# Altium project 示波器.PrjPcb
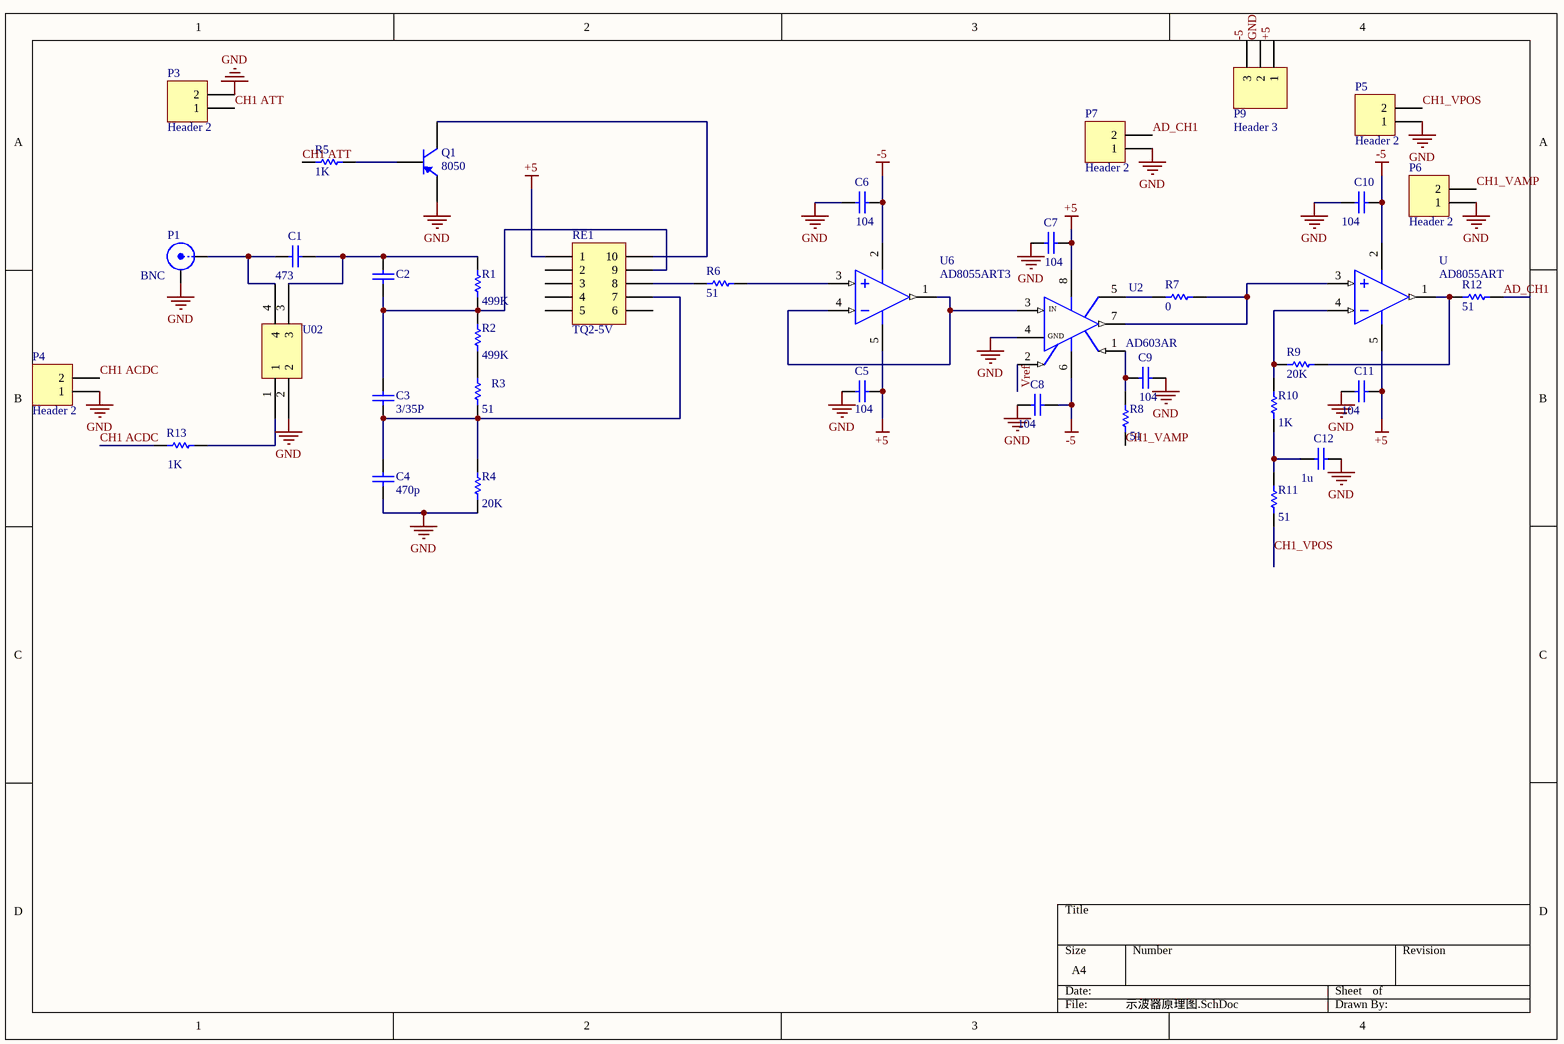
[diagram p0: 示波器原理图.SchDoc]
3 sheets, 99 parts. Net scope: global (net labels, ports and power ports of the same name join across sheets).
Board file: new示波器pcb.PcbDoc
Sheets:
  示波器原理图.SchDoc
  示波器原理图3.SchDoc
  示波器原理图7.SchDoc

## Sheet 示波器原理图.SchDoc
size A4

### Parts
C1  value 473  [PCBComponent_1]
C2  (no value)  [PCBComponent_1]
C3  value 3/35P  [PCBComponent_1]
C4  value 470p  [PCBComponent_1]
C5  value 104  [PCBComponent_1]
C6  104  [PCBComponent_1]
C7  value 104  [PCBComponent_1]
C8  value 104  [PCBComponent_1]
C9  value 104  [PCBComponent_1]
C10  value 104  [PCBComponent_1]
C11  value 104  [PCBComponent_1]
C12  value 1u  [PCBComponent_1]
P1  BNC  [BNC_RA CON]
P3  Header 2  [HDR1X2]
P4  Header 2  [HDR1X2]
P5  Header 2  [HDR1X2]
P6  Header 2  [HDR1X2]
P7  Header 2  [HDR1X2]
P9  Header 3  [HDR1X3]
Q1  8050  [PCBComponent_1]
R1  value 499K  [PCBComponent_1]
R2  value 499K  [PCBComponent_1]
R3  value 51  [PCBComponent_1]
R4  value 20K  [2012[0805]]
R5  value 1K  [PCBComponent_1]
R6  value 51  [PCBComponent_1]
R7  value 0  [2012[0805]]
R8  value 51  [2012[0805]]
R9  value 20K  [2012[0805]]
R10  value 1K  [2012[0805]]
R11  value 51  [2012[0805]]
R12  value 51  [2012[0805]]
R13  value 1K  [PCBComponent_1]
RE1  TQ2-5V  [PCBComponent_1]
U  AD8055ART  [SOT95P245X110-5N]
U2  AD603AR  [SOIC127P600X175-8N]
U02  (no value)  [SOP254P610X218-4N]
U6  AD8055ART3  [SOT95P245X110-5N]

### Nets
+5: C5.1 C7.2 C11.2 P9.1 RE1.1 U.5(V+) U2.8(V+) U6.5(V+)
-5: C6.1 C8.2 C10.2 P9.3 U.2(V-) U2.6(V-) U6.2(V-)
GND: C4.1 C5.2 C6.2 C7.1 C8.1 C9.2 C10.1 C11.1 C12.2 P1.2(Y) P3.2 P4.1 P5.1 P6.1 P7.1 P9.2 Q1.1(E) R4.1 U02.2 U2.4(COMM)
AD_CH1: P7.2 R12.1
CH1 ACDC: P4.2 R13.1
CH1 ATT: P3.1 R5.2
CH1_VAMP: P6.2 R8.1
CH1_VPOS: P5.2 R11.1
Vref: U2.2(G-)
NetC1_1: C1.1 P1.1(X) U02.4
NetC1_2: C1.2 C2.2 R1.2 U02.3
NetC2_1: C2.1 C3.2 R1.1 R2.2 RE1.9
NetC3_1: C3.1 C4.2 R3.1 R4.2 RE1.7
NetC9_1: C9.1 R8.2 U2.1(G+)
NetC12_1: C12.1 R10.1 R11.2
NetQ1_2: Q1.2(B) R5.1
NetQ1_3: Q1.3(C) RE1.10
NetR2_1: R2.1 R3.2
NetR6_1: R6.1 U6.3(IN+)
NetR6_2: R6.2 RE1.8
NetR7_1: R7.1 U.3(IN+) U2.7(VOUT)
NetR7_2: R7.2 U2.5(FDBK)
NetR9_1: R9.1 R12.2 U.1(OUT)
NetR9_2: R9.2 R10.2 U.4(IN-)
NetR13_2: R13.2 U02.1
NetU2_3: U2.3(VINP) U6.1(OUT) U6.4(IN-)

Not connected (* = marked no-connect by the designer): RE1 2 3 4 5 6

### Notes on the sheet
- (in symbol AD603AR) IN; GND

### Library data of the parts
C1-C12 = Cap: Capacitor; Published: 8-Jun-2000; LatestRevisionDate: 17-Jul-2002; LatestRevisionNote: Re-released for DXP Platform.; PackageReference: RAD-0.3; Publisher: Altium Limited
P1 = BNC: BNC Elbow Connector; LatestRevisionDate: 17-Jul-2002; LatestRevisionNote: Re-released for DXP Platform.; Publisher: Altium Limited
P3-P7 = Header 2: Header, 2-Pin; LatestRevisionDate: 17-Jul-2002; LatestRevisionNote: Re-released for DXP Platform.; Publisher: Altium Limited
P9 = Header 3: Header, 3-Pin; LatestRevisionDate: 17-Jul-2002; LatestRevisionNote: Re-released for DXP Platform.; Publisher: Altium Limited
Q1 = 2N3906: PNP General Purpose Amplifier; Published: 8-Jun-2000; LatestRevisionDate: 15-Jan-2003; LatestRevisionNote: PCB Footprint 'BCY-W3/D4.7' replaced; DatasheetDocument: 1997; PackageDocument: Sep-1998; PackageReference: TO-92A; Publisher: Altium Limited; Code_JEDEC: TO-92A; ComponentLink1Description: Manufacturer Link; ComponentLink1URL: http://www.fairchildsemi.com/; ComponentLink2Description: Datasheet; ComponentLink2URL: http://www.fairchildsemi.com/ds/2N%2F2N3906.pdf
R1-R3 R5 R6 R13 = Res1: Resistor; Published: 8-Jun-2000; LatestRevisionDate: 17-Jul-2002; LatestRevisionNote: Re-released for DXP Platform.; PackageReference: AXIAL-0.3; Publisher: Altium Limited
R4 R7-R12 = Res Semi: Semiconductor Resistor; Published: 8-Jun-2000; LatestRevisionDate: 17-Jul-2002; LatestRevisionNote: Re-released for DXP Platform.; PackageReference: AXIAL-0.5; Publisher: Altium Limited
RE1 U02 = Component_1
U U6 = AD8055ART: Low Cost, 300MHz Voltage Feedback Amplifier; Text Field7: Published 8-Jun-2000
U2 = AD603AR: Low-Noise, 90MHz Variable Gain Amplifier; Text Field7: Published 8-Jun-2000, Modified 10-July-2000: SIM Model Added.

## Sheet 示波器原理图3.SchDoc
size A4
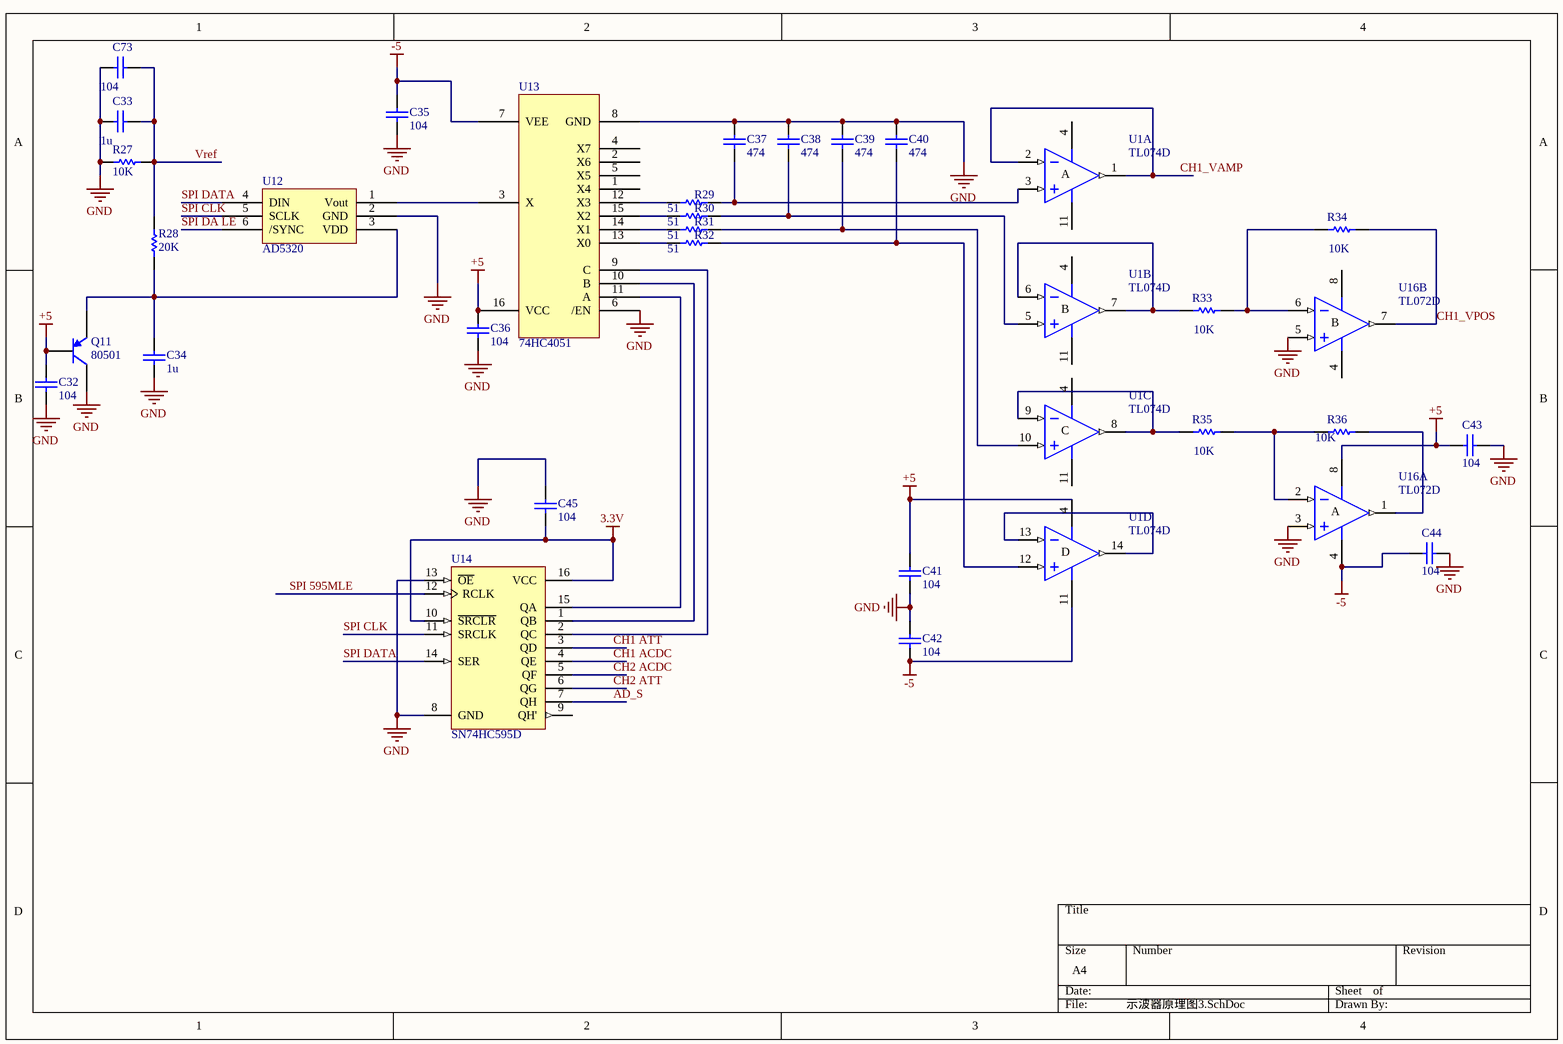
[diagram p1: 示波器原理图3.SchDoc]

### Parts
C32  value 104  [PCBComponent_1]
C33  value 1u  [PCBComponent_1]
C34  value 1u  [PCBComponent_1]
C35  value 104  [PCBComponent_1]
C36  value 104  [PCBComponent_1]
C37  value 474  [PCBComponent_1]
C38  value 474  [PCBComponent_1]
C39  value 474  [PCBComponent_1]
C40  value 474  [PCBComponent_1]
C41  value 104  [PCBComponent_1]
C42  value 104  [PCBComponent_1]
C43  value 104  [PCBComponent_1]
C44  value 104  [PCBComponent_1]
C45  value 104  [PCBComponent_1]
C73  value 104  [PCBComponent_1]
Q11  80501  [PCBComponent_1]
R27  value 10K  [PCBComponent_1]
R28  value 20K  [PCBComponent_1]
R29  51  [2012[0805]]
R30  51  [2012[0805]]
R31  51  [2012[0805]]
R32  51  [2012[0805]]
R33  value 10K  [2012[0805]]
R34  value 10K  [2012[0805]]
R35  value 10K  [2012[0805]]
R36  value 10K  [2012[0805]]
U1  TL074D  [SOP127P600X175-14N]  (parts A,B,C,D of 4)
U12  AD5320  [SOT86P280X110-6N]
U13  74HC4051  [SOP127P600X175-16N]
U14  SN74HC595D  [SOP127P600X175-16N]
U16  TL072D  [SOP127P600X175-8N]  (parts A,B of 2)

### Nets
3.3V: C45.1 U14.10(~{SRCLR}) U14.16(VCC)
+5: C32.2 C36.2 C41.1 C43.1 Q11.2(B) U1.4(V+) U13.16(VCC) U16.8(V+)
-5: C35.2 C42.2 C44.1 U1.11(V-) U13.7(VEE) U16.4(V-)
GND: C32.1 C33.1 C34.1 C35.1 C36.1 C37.2 C38.2 C39.2 C40.2 C41.2 C42.1 C43.2 C44.2 C45.2 C73.1 Q11.3(C) R27.2 U12.2(GND) U13.6(/EN) U13.8(GND) U14.8(GND) U14.13(~{OE}) U16.3(IN+) U16.5(IN+)
AD_S: U14.7(QH)
CH1 ACDC: U14.4(QE)
CH1 ATT: U14.3(QD)
CH1_VAMP: U1.1(OUT) U1.2(IN-)
CH1_VPOS: R34.2 U16.7(OUT)
CH2 ACDC: U14.5(QF)
CH2 ATT: U14.6(QG)
SPI 595MLE: U14.12(RCLK)
SPI CLK: U12.5(SCLK) U14.11(SRCLK)
SPI DA LE: U12.6(/SYNC)
SPI DATA: U12.4(DIN) U14.14(SER)
Vref: C33.2 C73.2 R27.1 R28.1
NetC34_2: C34.2 Q11.1(E) R28.2 U12.3(VDD)
NetC37_1: C37.1 R29.2 U1.3(IN+)
NetC38_1: C38.1 R30.2 U1.5(IN+)
NetC39_1: C39.1 R31.2 U1.10(IN+)
NetC40_1: C40.1 R32.2 U1.12(IN+)
NetR29_1: R29.1 U13.12(X3)
NetR30_1: R30.1 U13.15(X2)
NetR31_1: R31.1 U13.14(X1)
NetR32_1: R32.1 U13.13(X0)
NetR33_1: R33.1 U1.6(IN-) U1.7(OUT)
NetR33_2: R33.2 R34.1 U16.6(IN-)
NetR35_1: R35.1 U1.8(OUT) U1.9(IN-)
NetR35_2: R35.2 R36.1 U16.2(IN-)
NetR36_2: R36.2 U16.1(OUT)
NetU1_13: U1.13(IN-) U1.14(OUT)
NetU12_1: U12.1(Vout) U13.3(X)
NetU13_9: U13.9(C) U14.2(QC)
NetU13_10: U13.10(B) U14.1(QB)
NetU13_11: U13.11(A) U14.15(QA)

Not connected (* = marked no-connect by the designer): U13 1(X4) 2(X6) 4(X7) 5(X5); U14 9(QH')

### Notes on the sheet
- (in symbol TL072D, part A) A
- (in symbol TL072D, part B) B
- (in symbol TL074D, part A) A
- (in symbol TL074D, part B) B
- (in symbol TL074D, part C) C
- (in symbol TL074D, part D) D

### Library data of the parts
C32-C45 C73 = Cap: Capacitor; Published: 8-Jun-2000; LatestRevisionDate: 17-Jul-2002; LatestRevisionNote: Re-released for DXP Platform.; PackageReference: RAD-0.3; Publisher: Altium Limited
Q11 = 2N3906: PNP General Purpose Amplifier; Published: 8-Jun-2000; LatestRevisionDate: 15-Jan-2003; LatestRevisionNote: PCB Footprint 'BCY-W3/D4.7' replaced; DatasheetDocument: 1997; PackageDocument: Sep-1998; PackageReference: TO-92A; Publisher: Altium Limited; Code_JEDEC: TO-92A; ComponentLink1Description: Manufacturer Link; ComponentLink1URL: http://www.fairchildsemi.com/; ComponentLink2Description: Datasheet; ComponentLink2URL: http://www.fairchildsemi.com/ds/2N%2F2N3906.pdf
R27 R28 = Res1: Resistor; Published: 8-Jun-2000; LatestRevisionDate: 17-Jul-2002; LatestRevisionNote: Re-released for DXP Platform.; PackageReference: AXIAL-0.3; Publisher: Altium Limited
R29-R36 = Res Semi: Semiconductor Resistor; Published: 8-Jun-2000; LatestRevisionDate: 17-Jul-2002; LatestRevisionNote: Re-released for DXP Platform.; PackageReference: AXIAL-0.5; Publisher: Altium Limited
U1 = TL074D: Low-Noise JFET-Input Operational Amplifier; Published: 16-Jan-2001; LatestRevisionDate: 13-Apr-2006; LatestRevisionNote: IPC-7351 Footprint Added.; DatasheetVersion: Aug-1996; PackageVersion: Jan-1998; PackageReference: D014; Publisher: Altium Limited; PackageDescription: 14-Pin Small Outline Integrated Circuit 1.27 mm Pitch; Code_IPC: SOIC127P600-14; ComponentLink1Description: Manufacturer Link; ComponentLink1URL: http://www.ti.com/; ComponentLink2Description: Datasheet; ComponentLink2URL: http://www-s.ti.com/sc/ds/tl074.pdf
U12 U13 = Component_1
U14 = SN74HC595D: 8-Bit Shift Register with 3-State Output Registers; Published: 8-Jun-2000; LatestRevisionDate: 13-Apr-2006; LatestRevisionNote: IPC-7351 Footprint Added.; DatasheetVersion: May-1997; PackageVersion: Jan-1998; PackageReference: D016; Publisher: Altium Limited; PackageDescription: 16-Pin Small Outline Integrated Circuit 1.27 mm Pitch; Code_IPC: SOIC127P600-16; ComponentLink1Description: Manufacturer Link; ComponentLink1URL: http://www.ti.com/; ComponentLink2Description: Datasheet; ComponentLink2URL: http://www-s.ti.com/sc/ds/sn74hc595.pdf
U16 = TL072D: Low-Noise JFET-Input Operational Amplifier; Published: 16-Jan-2001; LatestRevisionDate: 13-Apr-2006; LatestRevisionNote: IPC-7351 Footprint Added.; DatasheetVersion: Aug-1996; PackageVersion: Jan-1998; PackageReference: D008; Publisher: Altium Limited; PackageDescription: 8-Pin Small Outline Integrated Circuit 1.27 mm Pitch; Code_IPC: SOIC127P600-8; ComponentLink1Description: Manufacturer Link; ComponentLink1URL: http://www.ti.com/; ComponentLink2Description: Datasheet; ComponentLink2URL: http://www-s.ti.com/sc/ds/tl072.pdf

## Sheet 示波器原理图7.SchDoc
size A4
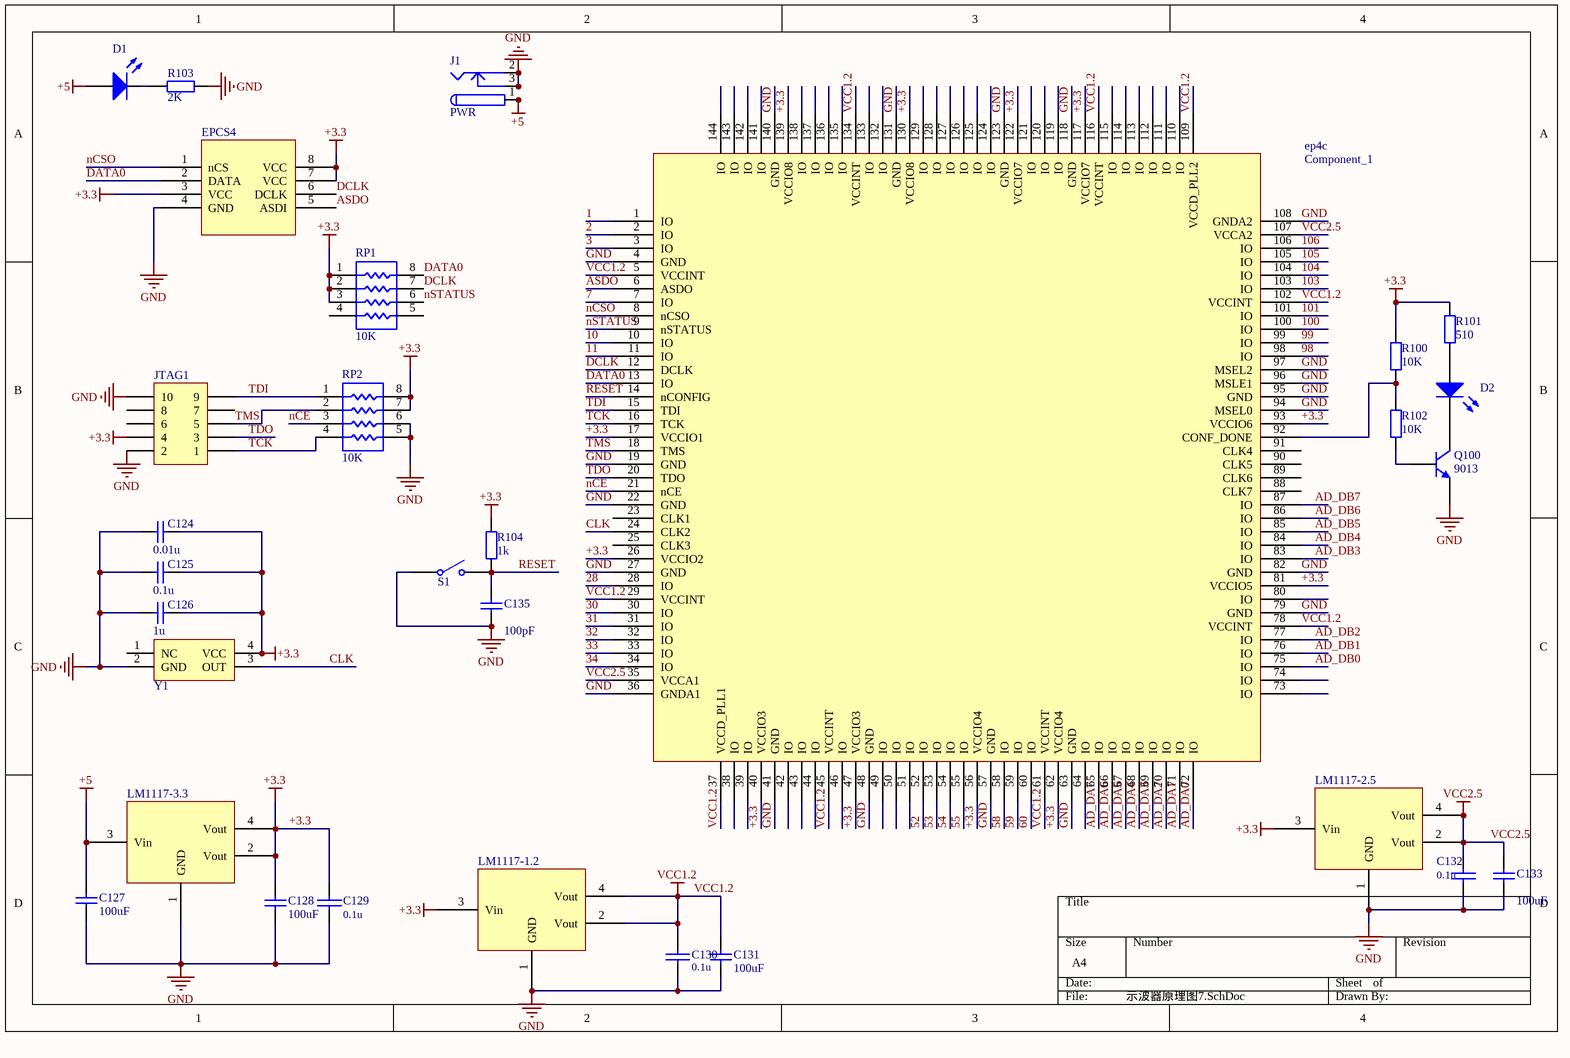
[diagram p2: 示波器原理图7.SchDoc]

### Parts
C124  value 0.01u  [PCBComponent_1]
C125  value 0.1u  [PCBComponent_1]
C126  value 1u  [PCBComponent_1]
C127  value 100uF  [C1206]
C128  value 100uF  [C1206]
C129  0.1u  [PCBComponent_1]
C130  0.1u  [PCBComponent_1]
C131  value 100uF  [C1206]
C132  0.1u  [PCBComponent_1]
C133  value 100uF  [C1206]
C135  value 100pF  [PCBComponent_1]
D1  LED0  [PCBComponent_1]  (value not drawn)
D2  LED0  [PCBComponent_1]  (value not drawn)
ep4c  Component_1  [PCBComponent_1]
EPCS4  (no value)  [PCBComponent_1]
J1  PWR  [KLD-0202]
JTAG1  (no value)  [HDR2X5]
LM1117-1.2  (no value)  [PCBComponent_1]
LM1117-2.5  (no value)  [PCBComponent_1]
LM1117-3.3  (no value)  [PCBComponent_1]
Q100  9013  [PCBComponent_1]
R100  value 10K  [PCBComponent_1]  (hidden comment: Res2)
R101  value 510  [PCBComponent_1]  (hidden comment: Res2)
R102  value 10K  [PCBComponent_1]  (hidden comment: Res2)
R103  value 2K  [PCBComponent_1]  (hidden comment: Res2)
R104  value 1k  [PCBComponent_1]  (hidden comment: Res2)
RP1  value 10K  [PCBComponent_1]  (hidden comment: Res Pack)
RP2  value 10K  [PCBComponent_1]  (hidden comment: Res Pack)
S1  SW-SPST  [PCBComponent_1]  (value not drawn)
Y1  Active crystal  [PCBComponent_1]  (value not drawn)

### Nets
+3.3: C124.1 C125.1 C126.1 C128.2 C129.1 ep4c.17(VCCIO1) ep4c.26(VCCIO2) ep4c.40(VCCIO3) ep4c.47(VCCIO3) ep4c.56(VCCIO4) ep4c.62(VCCIO4) ep4c.81(VCCIO5) ep4c.93(VCCIO6) ep4c.117(VCCIO7) ep4c.122(VCCIO7) ep4c.130(VCCIO8) ep4c.139(VCCIO8) EPCS4.3(VCC) EPCS4.7(VCC) EPCS4.8(VCC) JTAG1.4 LM1117-1.2.3(Vin) LM1117-2.5.3(Vin) LM1117-3.3.2(Vout) LM1117-3.3.4(Vout) R100.1 R101.1 R104.2 RP1.1 RP1.2 RP1.3 RP2.7 RP2.8 Y1.4(VCC)
+5: C127.2 D1.1(A) J1.1 J1.1A J1.1B LM1117-3.3.3(Vin)
GND: C124.2 C125.2 C126.2 C127.1 C128.1 C129.2 C130.2 C131.1 C132.2 C133.1 C135.1 ep4c.4(GND) ep4c.19(GND) ep4c.22(GND) ep4c.27(GND) ep4c.36(GNDA1) ep4c.41(GND) ep4c.48(GND) ep4c.57(GND) ep4c.63(GND) ep4c.79(GND) ep4c.82(GND) ep4c.94(MSEL0) ep4c.95(GND) ep4c.96(MSLE1) ep4c.97(MSEL2) ep4c.108(GNDA2) ep4c.118(GND) ep4c.123(GND) ep4c.131(GND) ep4c.140(GND) EPCS4.4(GND) J1.2 J1.2A J1.2B J1.3 J1.3A J1.3B JTAG1.2 JTAG1.10 LM1117-1.2.1(GND) LM1117-2.5.1(GND) LM1117-3.3.1(GND) Q100.1(E) R103.2 RP2.5 RP2.6 S1.1(COMMON) Y1.2(GND)
VCC1.2: C130.1 C131.2 ep4c.5(VCCINT) ep4c.29(VCCINT) ep4c.37(VCCD_PLL1) ep4c.45(VCCINT) ep4c.61(VCCINT) ep4c.78(VCCINT) ep4c.102(VCCINT) ep4c.109(VCCD_PLL2) ep4c.116(VCCINT) ep4c.134(VCCINT) LM1117-1.2.2(Vout) LM1117-1.2.4(Vout)
VCC2.5: C132.1 C133.2 ep4c.35(VCCA1) ep4c.107(VCCA2) LM1117-2.5.2(Vout) LM1117-2.5.4(Vout)
1: ep4c.1(IO)
2: ep4c.2(IO)
3: ep4c.3(IO)
7: ep4c.7(IO)
10: ep4c.10(IO)
11: ep4c.11(IO)
28: ep4c.28(IO)
30: ep4c.30(IO)
31: ep4c.31(IO)
32: ep4c.32(IO)
33: ep4c.33(IO)
34: ep4c.34(IO)
52: ep4c.52(IO)
53: ep4c.53(IO)
54: ep4c.54(IO)
55: ep4c.55(IO)
58: ep4c.58(IO)
59: ep4c.59(IO)
60: ep4c.60(IO)
98: ep4c.98(IO)
99: ep4c.99(IO)
100: ep4c.100(IO)
101: ep4c.101(IO)
103: ep4c.103(IO)
104: ep4c.104(IO)
105: ep4c.105(IO)
106: ep4c.106(IO)
AD_DA0: ep4c.72(IO)
AD_DA1: ep4c.71(IO)
AD_DA2: ep4c.70(IO)
AD_DA3: ep4c.69(IO)
AD_DA4: ep4c.68(IO)
AD_DA5: ep4c.67(IO)
AD_DA6: ep4c.66(IO)
AD_DA7: ep4c.65(IO)
AD_DB0: ep4c.75(IO)
AD_DB1: ep4c.76(IO)
AD_DB2: ep4c.77(IO)
AD_DB3: ep4c.83(IO)
AD_DB4: ep4c.84(IO)
AD_DB5: ep4c.85(IO)
AD_DB6: ep4c.86(IO)
AD_DB7: ep4c.87(IO)
ASDO: ep4c.6(ASDO) EPCS4.5(ASDI)
CLK: ep4c.24(CLK2) Y1.3(OUT)
DATA0: ep4c.13(IO) EPCS4.2(DATA) RP1.8
DCLK: ep4c.12(DCLK) EPCS4.6(DCLK) RP1.7
nCE: ep4c.21(nCE) RP2.3
nCSO: ep4c.8(nCSO) EPCS4.1(nCS)
nSTATUS: ep4c.9(nSTATUS) RP1.6
RESET: C135.2 ep4c.14(nCONFIG) R104.1 S1.2(NO)
TCK: ep4c.16(TCK) JTAG1.1 RP2.4
TDI: ep4c.15(TDI) JTAG1.9 RP2.1
TDO: ep4c.20(TDO) JTAG1.3
TMS: ep4c.18(TMS) JTAG1.5 RP2.2
NetD1_2: D1.2(K) R103.1
NetD2_1: D2.1(A) R101.2
NetD2_2: D2.2(K) Q100.3(C)
Netep4c_92: ep4c.92(CONF_DONE) R100.2 R102.1
NetQ100_2: Q100.2(B) R102.2

Not connected (* = marked no-connect by the designer): ep4c 23(CLK1) 25(CLK3) 38(IO) 39(IO) 42(IO) 43(IO) 44(IO) 46(IO) 49(IO) 50(IO) 51(IO) 64(IO) 73(IO) 74(IO) 80(IO) 88(CLK7) 89(CLK6) 90(CLK5) 91(CLK4) 110(IO) 111(IO) 112(IO) 113(IO) 114(IO) 115(IO) 119(IO) 120(IO) 121(IO) 124(IO) 125(IO) 126(IO) 127(IO) 128(IO) 129(IO) 132(IO) 133(IO) 135(IO) 136(IO) 137(IO) 138(IO) 141(IO) 142(IO) 143(IO) 144(IO); JTAG1 6 7 8; RP1 4 5; Y1 1(NC)

### Library data of the parts
C124-C128 C131 C133 C135 = Cap Semi: Capacitor (Semiconductor SIM Model); Published: 8-Jun-2000; LatestRevisionDate: 17-Jul-2002; LatestRevisionNote: Re-released for DXP Platform.; PackageReference: C1206; Publisher: Altium Limited
C129 C130 C132 = CAP: Capacitor
D1 D2 = LED0: Typical INFRARED GaAs LED; Published: 8-Jun-2000; LatestRevisionDate: 08-Jul-2005; LatestRevisionNote: Mech Layer 1 removed.; PackageReference: LED-0; Publisher: Altium Limited
EPCS4 LM1117-1.2 LM1117-2.5 LM1117-3.3 = Component_1
J1 = PWR2.5: Low Voltage Power Supply Connector; Published: 17-Dec-2003; DatasheetDocument: 09-May-2002; Publisher: Altium Limited; ComponentLink1Description: Manufacturer Link; ComponentLink1URL: http://domino.kycon.com/internet/Products.html
JTAG1 = Header 5X2: Header, 5-Pin, Dual row; LatestRevisionDate: 17-Jul-2002; LatestRevisionNote: Re-released for DXP Platform.; Publisher: Altium Limited
Q100 = 2N3904: NPN General Purpose Amplifier; Published: 8-Jun-2000; LatestRevisionDate: 15-Jan-2003; LatestRevisionNote: PCB Footprint 'BCY-W3/D4.7' replaced; DatasheetDocument: 1997; PackageDocument: Sep-1998; PackageReference: TO-92A; Publisher: Altium Limited; Code_JEDEC: TO-92A; ComponentLink1Description: Manufacturer Link; ComponentLink1URL: http://www.fairchildsemi.com/; ComponentLink2Description: Datasheet; ComponentLink2URL: http://www.fairchildsemi.com/ds/2N%2F2N3904.pdf
R100-R104 = Res2: Resistor; Published: 8-Jun-2000; LatestRevisionDate: 17-Jul-2002; LatestRevisionNote: Re-released for DXP Platform.; PackageReference: AXIAL-0.4; Publisher: Altium Limited
RP1 RP2 = Res Pack3: Isolated Resistor Network; Published: 24-Mar-1999; LatestRevisionDate: 17-Jul-2002; LatestRevisionNote: Re-released for DXP Platform.; PackageReference: SO-8; Publisher: Altium Limited
S1 = SW-SPST_1: Single-Pole, Single-Throw Switch; Published: 24-Mar-1999; LatestRevisionDate: 17-Jul-2002; LatestRevisionNote: Re-released for DXP Platform.; PackageReference: SPST-2; Publisher: Altium Limited

## Nets that join several sheets
+5: 示波器原理图 (8 pins), 示波器原理图3 (8 pins), 示波器原理图7 (6 pins)
-5: 示波器原理图 (7 pins), 示波器原理图3 (6 pins)
GND: 示波器原理图 (20 pins), 示波器原理图3 (24 pins), 示波器原理图7 (49 pins)
CH1 ACDC: 示波器原理图 (P4.2 R13.1), 示波器原理图3 (U14.4)
CH1 ATT: 示波器原理图 (P3.1 R5.2), 示波器原理图3 (U14.3)
CH1_VAMP: 示波器原理图 (P6.2 R8.1), 示波器原理图3 (U1.1 U1.2)
CH1_VPOS: 示波器原理图 (P5.2 R11.1), 示波器原理图3 (R34.2 U16.7)
Vref: 示波器原理图 (U2.2), 示波器原理图3 (C33.2 C73.2 R27.1 R28.1)